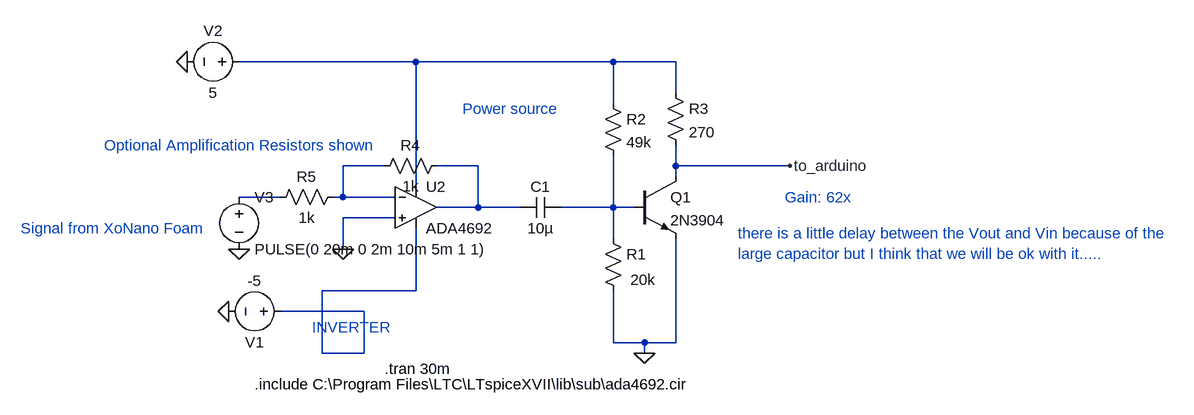
[diagram p0: schematic active_input_circuit.asc]
active_input_circuit.asc, the LTspice schematic file:
Version 4
SHEET 1 1616 680
WIRE -176 0 -448 0
WIRE 128 0 -176 0
WIRE 224 0 128 0
WIRE 224 48 224 0
WIRE 128 64 128 0
WIRE -224 160 -288 160
WIRE -80 160 -144 160
WIRE 224 160 224 128
WIRE 400 160 224 160
WIRE 224 176 224 160
WIRE -176 192 -176 0
WIRE -384 208 -448 208
WIRE -288 208 -288 160
WIRE -288 208 -304 208
WIRE -208 208 -288 208
WIRE -80 224 -80 160
WIRE -80 224 -144 224
WIRE -16 224 -80 224
WIRE 128 224 128 144
WIRE 128 224 48 224
WIRE 160 224 128 224
WIRE -208 240 -288 240
WIRE 128 272 128 224
WIRE -288 288 -288 240
WIRE -176 352 -176 256
WIRE -176 352 -320 352
WIRE -256 384 -384 384
WIRE 128 432 128 352
WIRE 176 432 128 432
WIRE 224 432 224 272
WIRE 224 432 176 432
WIRE -320 448 -320 352
WIRE -256 448 -256 384
WIRE -256 448 -320 448
WIRE 176 448 176 432
FLAG 176 448 0
FLAG 400 160 to_arduino
FLAG -528 0 0
FLAG -464 384 0
FLAG -288 288 0
FLAG -448 288 0
SYMBOL npn 160 176 R0
SYMATTR InstName Q1
SYMATTR Value 2N3904
SYMBOL res 112 256 R0
WINDOW 3 42 79 Left 2
SYMATTR Value 20k
SYMATTR InstName R1
SYMBOL res 112 48 R0
SYMATTR InstName R2
SYMATTR Value 49k
SYMBOL res 208 32 R0
SYMATTR InstName R3
SYMATTR Value 270
SYMBOL voltage -432 0 R90
WINDOW 0 -32 56 VBottom 2
WINDOW 3 32 56 VTop 2
WINDOW 123 0 0 Left 0
WINDOW 39 0 0 Left 0
SYMATTR InstName V2
SYMATTR Value 5
SYMBOL Opamps\\opamp2 -176 160 R0
SYMATTR InstName U2
SYMATTR Value ADA4692
SYMBOL voltage -368 384 R90
WINDOW 0 32 56 VTop 2
WINDOW 3 -32 56 VBottom 2
WINDOW 123 0 0 Left 0
WINDOW 39 0 0 Left 0
SYMATTR InstName V1
SYMATTR Value -5
SYMBOL voltage -448 192 R0
WINDOW 123 0 0 Left 0
WINDOW 39 0 0 Left 0
SYMATTR InstName V3
SYMATTR Value PULSE(0 20m 0 2m 10m 5m 1 1)
SYMBOL cap 48 208 R90
WINDOW 0 0 32 VBottom 2
WINDOW 3 32 32 VTop 2
SYMATTR InstName C1
SYMATTR Value 10µ
SYMBOL res -128 144 R90
WINDOW 0 0 56 VBottom 2
WINDOW 3 32 56 VTop 2
SYMATTR InstName R4
SYMATTR Value 1k
SYMBOL res -288 192 R90
WINDOW 0 0 56 VBottom 2
WINDOW 3 32 56 VTop 2
SYMATTR InstName R5
SYMATTR Value 1k
TEXT -104 72 Left 2 ;Power source
TEXT -784 256 Left 2 ;Signal from XoNano Foam
TEXT -224 472 Left 2 !.tran 30m
TEXT 392 208 Left 2 ;Gain: 62x
TEXT -424 496 Left 2 !.include C:\\Program Files\\LTC\\LTspiceXVII\\lib\\sub\\ada4692.cir
TEXT -336 408 Left 2 ;INVERTER
TEXT -656 128 Left 2 ;Optional Amplification Resistors shown
TEXT 320 264 Left 2 ;there is a little delay between the Vout and Vin because of the \nlarge capacitor but I think that we will be ok with it.....

The netlist it stands for:
* active_input_circuit.asc
Q1 to_arduino N005 0 0 2N3904
R1 N005 0 20k
R2 N001 N005 49k
R3 N001 to_arduino 270
V2 N001 0 5
XU2 0 N002 N001 N006 N003 ADA4692  ; pins In+ In- V+ V- OUT
V1 N006 0 -5
V3 N004 0 PULSE(0 20m 0 2m 10m 5m 1 1)
C1 N005 N003 10µ
R4 N003 N002 1k
R5 N002 N004 1k
.model NPN NPN
.model PNP PNP
.lib standard.bjt
* Power source
* Signal from XoNano Foam
.tran 30m
* Gain: 62x
.include C:\Program Files\LTC\LTspiceXVII\lib\sub\ada4692.cir
* INVERTER
* Optional Amplification Resistors shown
* there is a little delay between the Vout and Vin because of the
* large capacitor but I think that we will be ok with it.....
.backanno
.end